# Altium project BUSBAR_18650_12S.PrjPCB
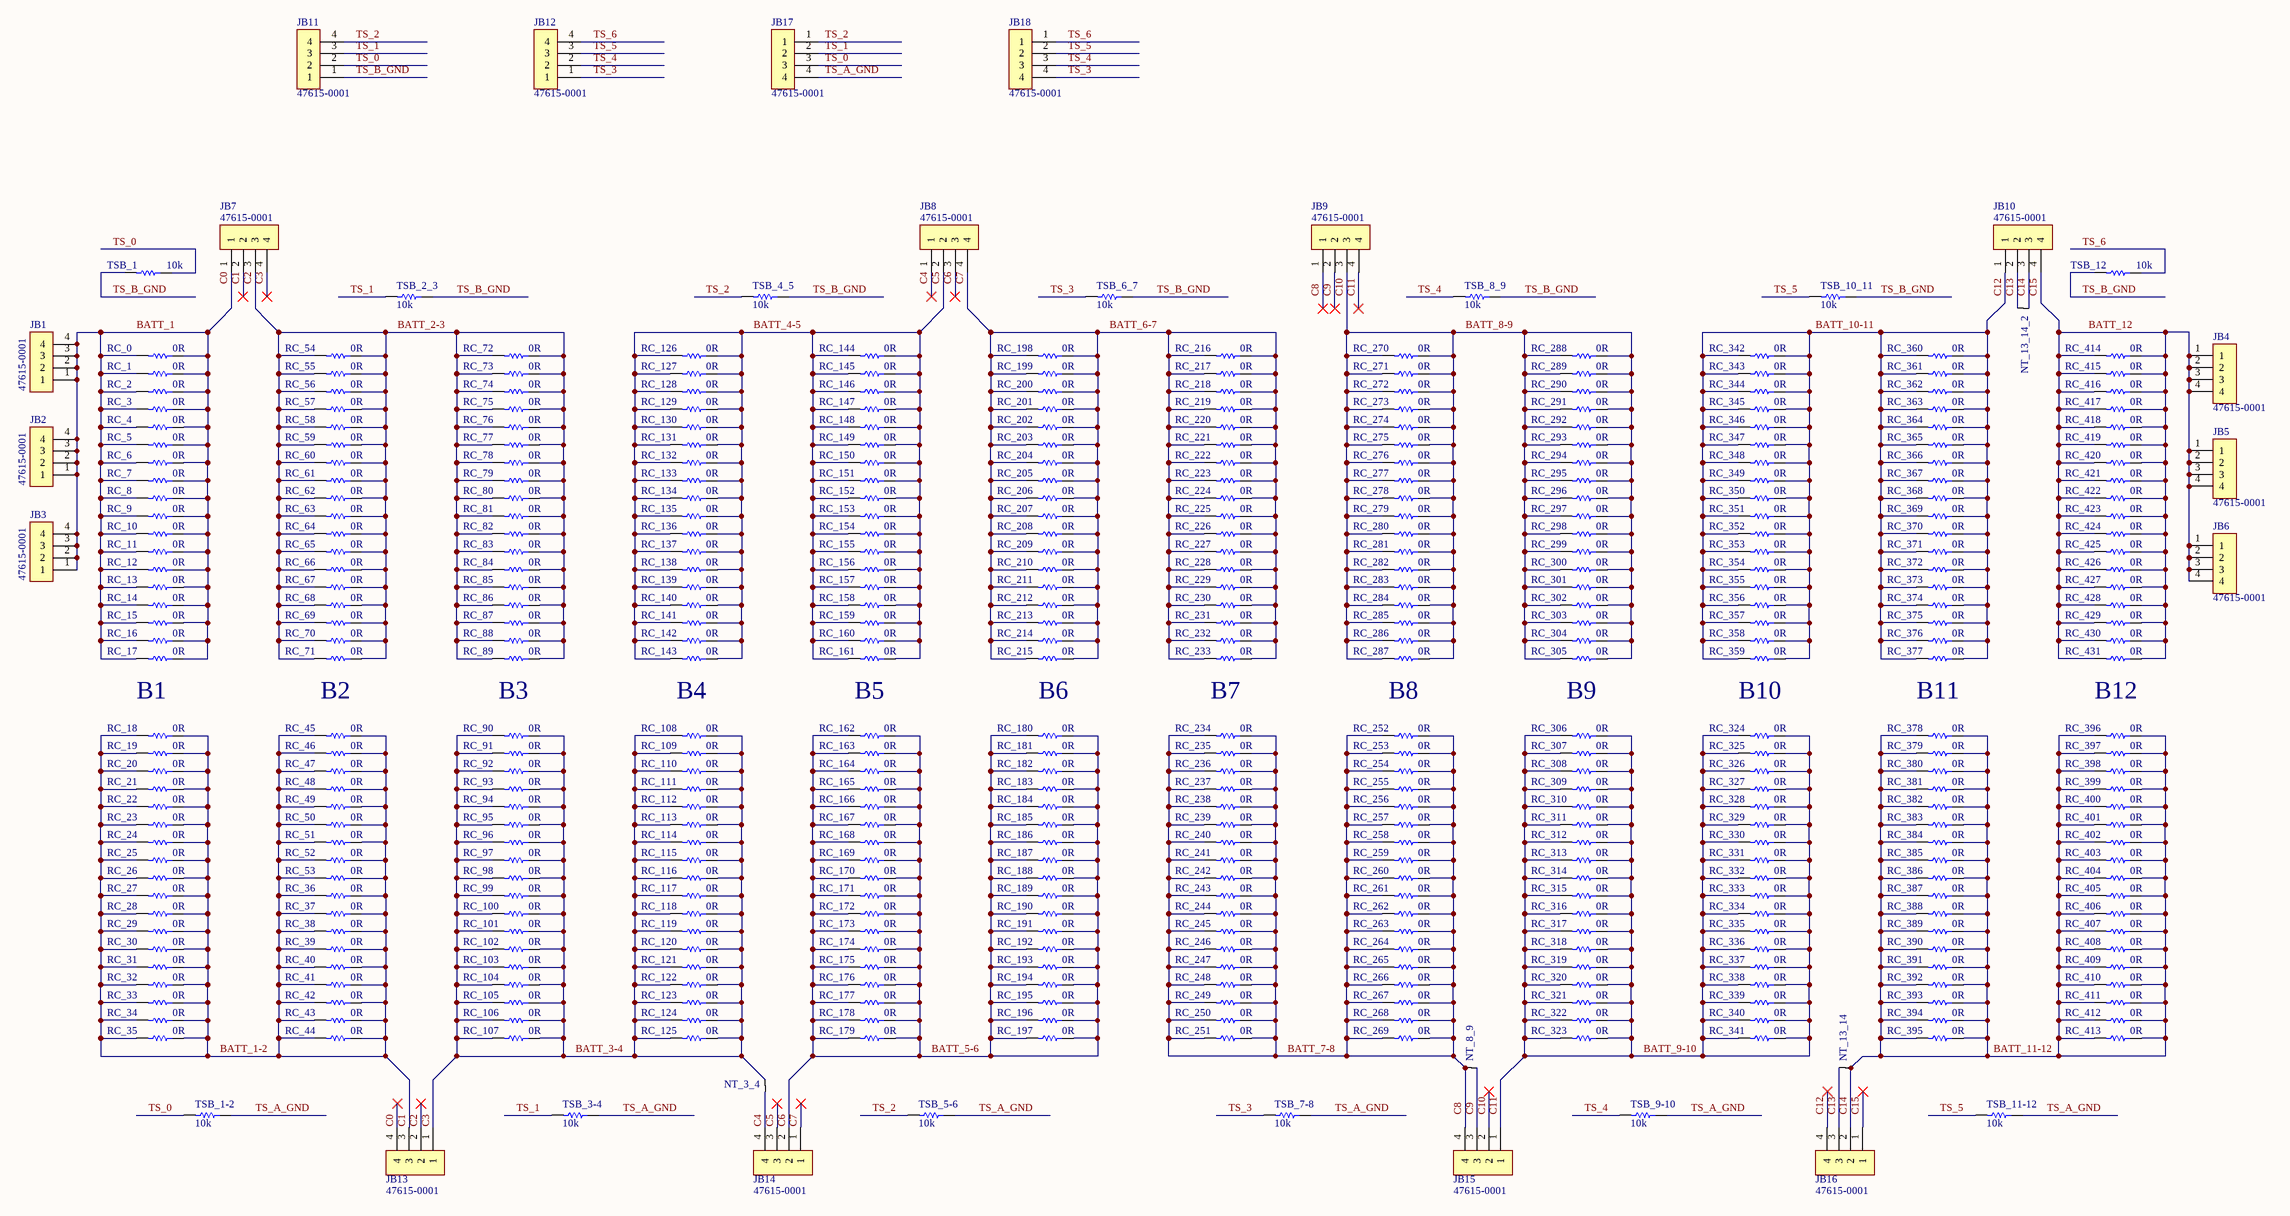
[diagram p0: BUSBAR_18650_12S.SchDoc]
1 sheet, 467 parts. Net scope: global (net labels, ports and power ports of the same name join across sheets).
Board file: BUSBAR_18650_12S.PcbDoc

## Sheet BUSBAR_18650_12S.SchDoc
size C

### Parts
JB1  47615-0001  [47615-0001]
JB2  47615-0001  [47615-0001]
JB3  47615-0001  [47615-0001]
JB4  47615-0001  [47615-0001]
JB5  47615-0001  [47615-0001]
JB6  47615-0001  [47615-0001]
JB7  47615-0001  [47615-0001]
JB8  47615-0001  [47615-0001]
JB9  47615-0001  [47615-0001]
JB10  47615-0001  [47615-0001]
JB11  47615-0001  [47615-0001]
JB12  47615-0001  [47615-0001]
JB13  47615-0001  [47615-0001]
JB14  47615-0001  [47615-0001]
JB15  47615-0001  [47615-0001]
JB16  47615-0001  [47615-0001]
JB17  47615-0001  [47615-0001]
JB18  47615-0001  [47615-0001]
NT_3_4  0  [NET_TIE]  (value not drawn)
NT_8_9  0  [NET_TIE]  (value not drawn)
NT_13_14  0  [NET_TIE]  (value not drawn)
NT_13_14_2  0  [NET_TIE]  (value not drawn)
RC_0  value 0R  [R_0603]  (hidden comment: 0603WAF0000T5E)
RC_1  value 0R  [R_0603]  (hidden comment: 0603WAF0000T5E)
RC_2  value 0R  [R_0603]  (hidden comment: 0603WAF0000T5E)
RC_3  value 0R  [R_0603]  (hidden comment: 0603WAF0000T5E)
RC_4  value 0R  [R_0603]  (hidden comment: 0603WAF0000T5E)
RC_5  value 0R  [R_0603]  (hidden comment: 0603WAF0000T5E)
RC_6  value 0R  [R_0603]  (hidden comment: 0603WAF0000T5E)
RC_7  value 0R  [R_0603]  (hidden comment: 0603WAF0000T5E)
RC_8  value 0R  [R_0603]  (hidden comment: 0603WAF0000T5E)
RC_9  value 0R  [R_0603]  (hidden comment: 0603WAF0000T5E)
RC_10  value 0R  [R_0603]  (hidden comment: 0603WAF0000T5E)
RC_11  value 0R  [R_0603]  (hidden comment: 0603WAF0000T5E)
RC_12  value 0R  [R_0603]  (hidden comment: 0603WAF0000T5E)
RC_13  value 0R  [R_0603]  (hidden comment: 0603WAF0000T5E)
RC_14  value 0R  [R_0603]  (hidden comment: 0603WAF0000T5E)
RC_15  value 0R  [R_0603]  (hidden comment: 0603WAF0000T5E)
RC_16  value 0R  [R_0603]  (hidden comment: 0603WAF0000T5E)
RC_17  value 0R  [R_0603]  (hidden comment: 0603WAF0000T5E)
RC_18  value 0R  [R_0603]  (hidden comment: 0603WAF0000T5E)
RC_19  value 0R  [R_0603]  (hidden comment: 0603WAF0000T5E)
RC_20  value 0R  [R_0603]  (hidden comment: 0603WAF0000T5E)
RC_21  value 0R  [R_0603]  (hidden comment: 0603WAF0000T5E)
RC_22  value 0R  [R_0603]  (hidden comment: 0603WAF0000T5E)
RC_23  value 0R  [R_0603]  (hidden comment: 0603WAF0000T5E)
RC_24  value 0R  [R_0603]  (hidden comment: 0603WAF0000T5E)
RC_25  value 0R  [R_0603]  (hidden comment: 0603WAF0000T5E)
RC_26  value 0R  [R_0603]  (hidden comment: 0603WAF0000T5E)
RC_27  value 0R  [R_0603]  (hidden comment: 0603WAF0000T5E)
RC_28  value 0R  [R_0603]  (hidden comment: 0603WAF0000T5E)
RC_29  value 0R  [R_0603]  (hidden comment: 0603WAF0000T5E)
RC_30  value 0R  [R_0603]  (hidden comment: 0603WAF0000T5E)
RC_31  value 0R  [R_0603]  (hidden comment: 0603WAF0000T5E)
RC_32  value 0R  [R_0603]  (hidden comment: 0603WAF0000T5E)
RC_33  value 0R  [R_0603]  (hidden comment: 0603WAF0000T5E)
RC_34  value 0R  [R_0603]  (hidden comment: 0603WAF0000T5E)
RC_35  value 0R  [R_0603]  (hidden comment: 0603WAF0000T5E)
RC_36  value 0R  [R_0603]  (hidden comment: 0603WAF0000T5E)
RC_37  value 0R  [R_0603]  (hidden comment: 0603WAF0000T5E)
RC_38  value 0R  [R_0603]  (hidden comment: 0603WAF0000T5E)
RC_39  value 0R  [R_0603]  (hidden comment: 0603WAF0000T5E)
RC_40  value 0R  [R_0603]  (hidden comment: 0603WAF0000T5E)
RC_41  value 0R  [R_0603]  (hidden comment: 0603WAF0000T5E)
RC_42  value 0R  [R_0603]  (hidden comment: 0603WAF0000T5E)
RC_43  value 0R  [R_0603]  (hidden comment: 0603WAF0000T5E)
RC_44  value 0R  [R_0603]  (hidden comment: 0603WAF0000T5E)
RC_45  value 0R  [R_0603]  (hidden comment: 0603WAF0000T5E)
RC_46  value 0R  [R_0603]  (hidden comment: 0603WAF0000T5E)
RC_47  value 0R  [R_0603]  (hidden comment: 0603WAF0000T5E)
RC_48  value 0R  [R_0603]  (hidden comment: 0603WAF0000T5E)
RC_49  value 0R  [R_0603]  (hidden comment: 0603WAF0000T5E)
RC_50  value 0R  [R_0603]  (hidden comment: 0603WAF0000T5E)
RC_51  value 0R  [R_0603]  (hidden comment: 0603WAF0000T5E)
RC_52  value 0R  [R_0603]  (hidden comment: 0603WAF0000T5E)
RC_53  value 0R  [R_0603]  (hidden comment: 0603WAF0000T5E)
RC_54  value 0R  [R_0603]  (hidden comment: 0603WAF0000T5E)
RC_55  value 0R  [R_0603]  (hidden comment: 0603WAF0000T5E)
RC_56  value 0R  [R_0603]  (hidden comment: 0603WAF0000T5E)
RC_57  value 0R  [R_0603]  (hidden comment: 0603WAF0000T5E)
RC_58  value 0R  [R_0603]  (hidden comment: 0603WAF0000T5E)
RC_59  value 0R  [R_0603]  (hidden comment: 0603WAF0000T5E)
RC_60  value 0R  [R_0603]  (hidden comment: 0603WAF0000T5E)
RC_61  value 0R  [R_0603]  (hidden comment: 0603WAF0000T5E)
RC_62  value 0R  [R_0603]  (hidden comment: 0603WAF0000T5E)
RC_63  value 0R  [R_0603]  (hidden comment: 0603WAF0000T5E)
RC_64  value 0R  [R_0603]  (hidden comment: 0603WAF0000T5E)
RC_65  value 0R  [R_0603]  (hidden comment: 0603WAF0000T5E)
RC_66  value 0R  [R_0603]  (hidden comment: 0603WAF0000T5E)
RC_67  value 0R  [R_0603]  (hidden comment: 0603WAF0000T5E)
RC_68  value 0R  [R_0603]  (hidden comment: 0603WAF0000T5E)
RC_69  value 0R  [R_0603]  (hidden comment: 0603WAF0000T5E)
RC_70  value 0R  [R_0603]  (hidden comment: 0603WAF0000T5E)
RC_71  value 0R  [R_0603]  (hidden comment: 0603WAF0000T5E)
RC_72  value 0R  [R_0603]  (hidden comment: 0603WAF0000T5E)
RC_73  value 0R  [R_0603]  (hidden comment: 0603WAF0000T5E)
RC_74  value 0R  [R_0603]  (hidden comment: 0603WAF0000T5E)
RC_75  value 0R  [R_0603]  (hidden comment: 0603WAF0000T5E)
RC_76  value 0R  [R_0603]  (hidden comment: 0603WAF0000T5E)
RC_77  value 0R  [R_0603]  (hidden comment: 0603WAF0000T5E)
RC_78  value 0R  [R_0603]  (hidden comment: 0603WAF0000T5E)
RC_79  value 0R  [R_0603]  (hidden comment: 0603WAF0000T5E)
RC_80  value 0R  [R_0603]  (hidden comment: 0603WAF0000T5E)
RC_81  value 0R  [R_0603]  (hidden comment: 0603WAF0000T5E)
RC_82  value 0R  [R_0603]  (hidden comment: 0603WAF0000T5E)
RC_83  value 0R  [R_0603]  (hidden comment: 0603WAF0000T5E)
RC_84  value 0R  [R_0603]  (hidden comment: 0603WAF0000T5E)
RC_85  value 0R  [R_0603]  (hidden comment: 0603WAF0000T5E)
RC_86  value 0R  [R_0603]  (hidden comment: 0603WAF0000T5E)
RC_87  value 0R  [R_0603]  (hidden comment: 0603WAF0000T5E)
RC_88  value 0R  [R_0603]  (hidden comment: 0603WAF0000T5E)
RC_89  value 0R  [R_0603]  (hidden comment: 0603WAF0000T5E)
RC_90  value 0R  [R_0603]  (hidden comment: 0603WAF0000T5E)
RC_91  value 0R  [R_0603]  (hidden comment: 0603WAF0000T5E)
RC_92  value 0R  [R_0603]  (hidden comment: 0603WAF0000T5E)
RC_93  value 0R  [R_0603]  (hidden comment: 0603WAF0000T5E)
RC_94  value 0R  [R_0603]  (hidden comment: 0603WAF0000T5E)
RC_95  value 0R  [R_0603]  (hidden comment: 0603WAF0000T5E)
RC_96  value 0R  [R_0603]  (hidden comment: 0603WAF0000T5E)
RC_97  value 0R  [R_0603]  (hidden comment: 0603WAF0000T5E)
RC_98  value 0R  [R_0603]  (hidden comment: 0603WAF0000T5E)
RC_99  value 0R  [R_0603]  (hidden comment: 0603WAF0000T5E)
RC_100  value 0R  [R_0603]  (hidden comment: 0603WAF0000T5E)
RC_101  value 0R  [R_0603]  (hidden comment: 0603WAF0000T5E)
RC_102  value 0R  [R_0603]  (hidden comment: 0603WAF0000T5E)
RC_103  value 0R  [R_0603]  (hidden comment: 0603WAF0000T5E)
RC_104  value 0R  [R_0603]  (hidden comment: 0603WAF0000T5E)
RC_105  value 0R  [R_0603]  (hidden comment: 0603WAF0000T5E)
RC_106  value 0R  [R_0603]  (hidden comment: 0603WAF0000T5E)
RC_107  value 0R  [R_0603]  (hidden comment: 0603WAF0000T5E)
RC_108  value 0R  [R_0603]  (hidden comment: 0603WAF0000T5E)
RC_109  value 0R  [R_0603]  (hidden comment: 0603WAF0000T5E)
RC_110  value 0R  [R_0603]  (hidden comment: 0603WAF0000T5E)
RC_111  value 0R  [R_0603]  (hidden comment: 0603WAF0000T5E)
RC_112  value 0R  [R_0603]  (hidden comment: 0603WAF0000T5E)
RC_113  value 0R  [R_0603]  (hidden comment: 0603WAF0000T5E)
RC_114  value 0R  [R_0603]  (hidden comment: 0603WAF0000T5E)
RC_115  value 0R  [R_0603]  (hidden comment: 0603WAF0000T5E)
RC_116  value 0R  [R_0603]  (hidden comment: 0603WAF0000T5E)
RC_117  value 0R  [R_0603]  (hidden comment: 0603WAF0000T5E)
RC_118  value 0R  [R_0603]  (hidden comment: 0603WAF0000T5E)
RC_119  value 0R  [R_0603]  (hidden comment: 0603WAF0000T5E)
RC_120  value 0R  [R_0603]  (hidden comment: 0603WAF0000T5E)
RC_121  value 0R  [R_0603]  (hidden comment: 0603WAF0000T5E)
RC_122  value 0R  [R_0603]  (hidden comment: 0603WAF0000T5E)
RC_123  value 0R  [R_0603]  (hidden comment: 0603WAF0000T5E)
RC_124  value 0R  [R_0603]  (hidden comment: 0603WAF0000T5E)
RC_125  value 0R  [R_0603]  (hidden comment: 0603WAF0000T5E)
RC_126  value 0R  [R_0603]  (hidden comment: 0603WAF0000T5E)
RC_127  value 0R  [R_0603]  (hidden comment: 0603WAF0000T5E)
RC_128  value 0R  [R_0603]  (hidden comment: 0603WAF0000T5E)
RC_129  value 0R  [R_0603]  (hidden comment: 0603WAF0000T5E)
RC_130  value 0R  [R_0603]  (hidden comment: 0603WAF0000T5E)
RC_131  value 0R  [R_0603]  (hidden comment: 0603WAF0000T5E)
RC_132  value 0R  [R_0603]  (hidden comment: 0603WAF0000T5E)
RC_133  value 0R  [R_0603]  (hidden comment: 0603WAF0000T5E)
RC_134  value 0R  [R_0603]  (hidden comment: 0603WAF0000T5E)
RC_135  value 0R  [R_0603]  (hidden comment: 0603WAF0000T5E)
RC_136  value 0R  [R_0603]  (hidden comment: 0603WAF0000T5E)
RC_137  value 0R  [R_0603]  (hidden comment: 0603WAF0000T5E)
RC_138  value 0R  [R_0603]  (hidden comment: 0603WAF0000T5E)
RC_139  value 0R  [R_0603]  (hidden comment: 0603WAF0000T5E)
RC_140  value 0R  [R_0603]  (hidden comment: 0603WAF0000T5E)
RC_141  value 0R  [R_0603]  (hidden comment: 0603WAF0000T5E)
RC_142  value 0R  [R_0603]  (hidden comment: 0603WAF0000T5E)
RC_143  value 0R  [R_0603]  (hidden comment: 0603WAF0000T5E)
RC_144  value 0R  [R_0603]  (hidden comment: 0603WAF0000T5E)
RC_145  value 0R  [R_0603]  (hidden comment: 0603WAF0000T5E)
RC_146  value 0R  [R_0603]  (hidden comment: 0603WAF0000T5E)
RC_147  value 0R  [R_0603]  (hidden comment: 0603WAF0000T5E)
RC_148  value 0R  [R_0603]  (hidden comment: 0603WAF0000T5E)
RC_149  value 0R  [R_0603]  (hidden comment: 0603WAF0000T5E)
RC_150  value 0R  [R_0603]  (hidden comment: 0603WAF0000T5E)
RC_151  value 0R  [R_0603]  (hidden comment: 0603WAF0000T5E)
RC_152  value 0R  [R_0603]  (hidden comment: 0603WAF0000T5E)
RC_153  value 0R  [R_0603]  (hidden comment: 0603WAF0000T5E)
RC_154  value 0R  [R_0603]  (hidden comment: 0603WAF0000T5E)
RC_155  value 0R  [R_0603]  (hidden comment: 0603WAF0000T5E)
RC_156  value 0R  [R_0603]  (hidden comment: 0603WAF0000T5E)
RC_157  value 0R  [R_0603]  (hidden comment: 0603WAF0000T5E)
RC_158  value 0R  [R_0603]  (hidden comment: 0603WAF0000T5E)
RC_159  value 0R  [R_0603]  (hidden comment: 0603WAF0000T5E)
RC_160  value 0R  [R_0603]  (hidden comment: 0603WAF0000T5E)
RC_161  value 0R  [R_0603]  (hidden comment: 0603WAF0000T5E)
RC_162  value 0R  [R_0603]  (hidden comment: 0603WAF0000T5E)
RC_163  value 0R  [R_0603]  (hidden comment: 0603WAF0000T5E)
RC_164  value 0R  [R_0603]  (hidden comment: 0603WAF0000T5E)
RC_165  value 0R  [R_0603]  (hidden comment: 0603WAF0000T5E)
RC_166  value 0R  [R_0603]  (hidden comment: 0603WAF0000T5E)
RC_167  value 0R  [R_0603]  (hidden comment: 0603WAF0000T5E)
RC_168  value 0R  [R_0603]  (hidden comment: 0603WAF0000T5E)
RC_169  value 0R  [R_0603]  (hidden comment: 0603WAF0000T5E)
RC_170  value 0R  [R_0603]  (hidden comment: 0603WAF0000T5E)
RC_171  value 0R  [R_0603]  (hidden comment: 0603WAF0000T5E)
RC_172  value 0R  [R_0603]  (hidden comment: 0603WAF0000T5E)
RC_173  value 0R  [R_0603]  (hidden comment: 0603WAF0000T5E)
RC_174  value 0R  [R_0603]  (hidden comment: 0603WAF0000T5E)
RC_175  value 0R  [R_0603]  (hidden comment: 0603WAF0000T5E)
RC_176  value 0R  [R_0603]  (hidden comment: 0603WAF0000T5E)
RC_177  value 0R  [R_0603]  (hidden comment: 0603WAF0000T5E)
RC_178  value 0R  [R_0603]  (hidden comment: 0603WAF0000T5E)
RC_179  value 0R  [R_0603]  (hidden comment: 0603WAF0000T5E)
RC_180  value 0R  [R_0603]  (hidden comment: 0603WAF0000T5E)
RC_181  value 0R  [R_0603]  (hidden comment: 0603WAF0000T5E)
RC_182  value 0R  [R_0603]  (hidden comment: 0603WAF0000T5E)
RC_183  value 0R  [R_0603]  (hidden comment: 0603WAF0000T5E)
RC_184  value 0R  [R_0603]  (hidden comment: 0603WAF0000T5E)
RC_185  value 0R  [R_0603]  (hidden comment: 0603WAF0000T5E)
RC_186  value 0R  [R_0603]  (hidden comment: 0603WAF0000T5E)
RC_187  value 0R  [R_0603]  (hidden comment: 0603WAF0000T5E)
RC_188  value 0R  [R_0603]  (hidden comment: 0603WAF0000T5E)
RC_189  value 0R  [R_0603]  (hidden comment: 0603WAF0000T5E)
RC_190  value 0R  [R_0603]  (hidden comment: 0603WAF0000T5E)
RC_191  value 0R  [R_0603]  (hidden comment: 0603WAF0000T5E)
RC_192  value 0R  [R_0603]  (hidden comment: 0603WAF0000T5E)
RC_193  value 0R  [R_0603]  (hidden comment: 0603WAF0000T5E)
RC_194  value 0R  [R_0603]  (hidden comment: 0603WAF0000T5E)
RC_195  value 0R  [R_0603]  (hidden comment: 0603WAF0000T5E)
RC_196  value 0R  [R_0603]  (hidden comment: 0603WAF0000T5E)
RC_197  value 0R  [R_0603]  (hidden comment: 0603WAF0000T5E)
RC_198  value 0R  [R_0603]  (hidden comment: 0603WAF0000T5E)
RC_199  value 0R  [R_0603]  (hidden comment: 0603WAF0000T5E)
RC_200  value 0R  [R_0603]  (hidden comment: 0603WAF0000T5E)
RC_201  value 0R  [R_0603]  (hidden comment: 0603WAF0000T5E)
RC_202  value 0R  [R_0603]  (hidden comment: 0603WAF0000T5E)
RC_203  value 0R  [R_0603]  (hidden comment: 0603WAF0000T5E)
RC_204  value 0R  [R_0603]  (hidden comment: 0603WAF0000T5E)
RC_205  value 0R  [R_0603]  (hidden comment: 0603WAF0000T5E)
RC_206  value 0R  [R_0603]  (hidden comment: 0603WAF0000T5E)
RC_207  value 0R  [R_0603]  (hidden comment: 0603WAF0000T5E)
RC_208  value 0R  [R_0603]  (hidden comment: 0603WAF0000T5E)
RC_209  value 0R  [R_0603]  (hidden comment: 0603WAF0000T5E)
RC_210  value 0R  [R_0603]  (hidden comment: 0603WAF0000T5E)
RC_211  value 0R  [R_0603]  (hidden comment: 0603WAF0000T5E)
RC_212  value 0R  [R_0603]  (hidden comment: 0603WAF0000T5E)
RC_213  value 0R  [R_0603]  (hidden comment: 0603WAF0000T5E)
RC_214  value 0R  [R_0603]  (hidden comment: 0603WAF0000T5E)
RC_215  value 0R  [R_0603]  (hidden comment: 0603WAF0000T5E)
RC_216  value 0R  [R_0603]  (hidden comment: 0603WAF0000T5E)
RC_217  value 0R  [R_0603]  (hidden comment: 0603WAF0000T5E)
RC_218  value 0R  [R_0603]  (hidden comment: 0603WAF0000T5E)
RC_219  value 0R  [R_0603]  (hidden comment: 0603WAF0000T5E)
RC_220  value 0R  [R_0603]  (hidden comment: 0603WAF0000T5E)
RC_221  value 0R  [R_0603]  (hidden comment: 0603WAF0000T5E)
RC_222  value 0R  [R_0603]  (hidden comment: 0603WAF0000T5E)
RC_223  value 0R  [R_0603]  (hidden comment: 0603WAF0000T5E)
RC_224  value 0R  [R_0603]  (hidden comment: 0603WAF0000T5E)
RC_225  value 0R  [R_0603]  (hidden comment: 0603WAF0000T5E)
RC_226  value 0R  [R_0603]  (hidden comment: 0603WAF0000T5E)
RC_227  value 0R  [R_0603]  (hidden comment: 0603WAF0000T5E)
RC_228  value 0R  [R_0603]  (hidden comment: 0603WAF0000T5E)
RC_229  value 0R  [R_0603]  (hidden comment: 0603WAF0000T5E)
RC_230  value 0R  [R_0603]  (hidden comment: 0603WAF0000T5E)
RC_231  value 0R  [R_0603]  (hidden comment: 0603WAF0000T5E)
RC_232  value 0R  [R_0603]  (hidden comment: 0603WAF0000T5E)
RC_233  value 0R  [R_0603]  (hidden comment: 0603WAF0000T5E)
RC_234  value 0R  [R_0603]  (hidden comment: 0603WAF0000T5E)
RC_235  value 0R  [R_0603]  (hidden comment: 0603WAF0000T5E)
RC_236  value 0R  [R_0603]  (hidden comment: 0603WAF0000T5E)
RC_237  value 0R  [R_0603]  (hidden comment: 0603WAF0000T5E)
RC_238  value 0R  [R_0603]  (hidden comment: 0603WAF0000T5E)
RC_239  value 0R  [R_0603]  (hidden comment: 0603WAF0000T5E)
RC_240  value 0R  [R_0603]  (hidden comment: 0603WAF0000T5E)
RC_241  value 0R  [R_0603]  (hidden comment: 0603WAF0000T5E)
RC_242  value 0R  [R_0603]  (hidden comment: 0603WAF0000T5E)
RC_243  value 0R  [R_0603]  (hidden comment: 0603WAF0000T5E)
RC_244  value 0R  [R_0603]  (hidden comment: 0603WAF0000T5E)
RC_245  value 0R  [R_0603]  (hidden comment: 0603WAF0000T5E)
RC_246  value 0R  [R_0603]  (hidden comment: 0603WAF0000T5E)
RC_247  value 0R  [R_0603]  (hidden comment: 0603WAF0000T5E)
RC_248  value 0R  [R_0603]  (hidden comment: 0603WAF0000T5E)
RC_249  value 0R  [R_0603]  (hidden comment: 0603WAF0000T5E)
RC_250  value 0R  [R_0603]  (hidden comment: 0603WAF0000T5E)
RC_251  value 0R  [R_0603]  (hidden comment: 0603WAF0000T5E)
RC_252  value 0R  [R_0603]  (hidden comment: 0603WAF0000T5E)
RC_253  value 0R  [R_0603]  (hidden comment: 0603WAF0000T5E)
RC_254  value 0R  [R_0603]  (hidden comment: 0603WAF0000T5E)
RC_255  value 0R  [R_0603]  (hidden comment: 0603WAF0000T5E)
RC_256  value 0R  [R_0603]  (hidden comment: 0603WAF0000T5E)
RC_257  value 0R  [R_0603]  (hidden comment: 0603WAF0000T5E)
RC_258  value 0R  [R_0603]  (hidden comment: 0603WAF0000T5E)
RC_259  value 0R  [R_0603]  (hidden comment: 0603WAF0000T5E)
RC_260  value 0R  [R_0603]  (hidden comment: 0603WAF0000T5E)
RC_261  value 0R  [R_0603]  (hidden comment: 0603WAF0000T5E)
RC_262  value 0R  [R_0603]  (hidden comment: 0603WAF0000T5E)
RC_263  value 0R  [R_0603]  (hidden comment: 0603WAF0000T5E)
RC_264  value 0R  [R_0603]  (hidden comment: 0603WAF0000T5E)
RC_265  value 0R  [R_0603]  (hidden comment: 0603WAF0000T5E)
RC_266  value 0R  [R_0603]  (hidden comment: 0603WAF0000T5E)
RC_267  value 0R  [R_0603]  (hidden comment: 0603WAF0000T5E)
RC_268  value 0R  [R_0603]  (hidden comment: 0603WAF0000T5E)
RC_269  value 0R  [R_0603]  (hidden comment: 0603WAF0000T5E)
RC_270  value 0R  [R_0603]  (hidden comment: 0603WAF0000T5E)
RC_271  value 0R  [R_0603]  (hidden comment: 0603WAF0000T5E)
RC_272  value 0R  [R_0603]  (hidden comment: 0603WAF0000T5E)
RC_273  value 0R  [R_0603]  (hidden comment: 0603WAF0000T5E)
RC_274  value 0R  [R_0603]  (hidden comment: 0603WAF0000T5E)
RC_275  value 0R  [R_0603]  (hidden comment: 0603WAF0000T5E)
RC_276  value 0R  [R_0603]  (hidden comment: 0603WAF0000T5E)
RC_277  value 0R  [R_0603]  (hidden comment: 0603WAF0000T5E)
RC_278  value 0R  [R_0603]  (hidden comment: 0603WAF0000T5E)
RC_279  value 0R  [R_0603]  (hidden comment: 0603WAF0000T5E)
RC_280  value 0R  [R_0603]  (hidden comment: 0603WAF0000T5E)
RC_281  value 0R  [R_0603]  (hidden comment: 0603WAF0000T5E)
RC_282  value 0R  [R_0603]  (hidden comment: 0603WAF0000T5E)
RC_283  value 0R  [R_0603]  (hidden comment: 0603WAF0000T5E)
RC_284  value 0R  [R_0603]  (hidden comment: 0603WAF0000T5E)
RC_285  value 0R  [R_0603]  (hidden comment: 0603WAF0000T5E)
RC_286  value 0R  [R_0603]  (hidden comment: 0603WAF0000T5E)
RC_287  value 0R  [R_0603]  (hidden comment: 0603WAF0000T5E)
RC_288  value 0R  [R_0603]  (hidden comment: 0603WAF0000T5E)
RC_289  value 0R  [R_0603]  (hidden comment: 0603WAF0000T5E)
RC_290  value 0R  [R_0603]  (hidden comment: 0603WAF0000T5E)
RC_291  value 0R  [R_0603]  (hidden comment: 0603WAF0000T5E)
RC_292  value 0R  [R_0603]  (hidden comment: 0603WAF0000T5E)
RC_293  value 0R  [R_0603]  (hidden comment: 0603WAF0000T5E)
RC_294  value 0R  [R_0603]  (hidden comment: 0603WAF0000T5E)
RC_295  value 0R  [R_0603]  (hidden comment: 0603WAF0000T5E)
RC_296  value 0R  [R_0603]  (hidden comment: 0603WAF0000T5E)
RC_297  value 0R  [R_0603]  (hidden comment: 0603WAF0000T5E)
RC_298  value 0R  [R_0603]  (hidden comment: 0603WAF0000T5E)
RC_299  value 0R  [R_0603]  (hidden comment: 0603WAF0000T5E)
RC_300  value 0R  [R_0603]  (hidden comment: 0603WAF0000T5E)
RC_301  value 0R  [R_0603]  (hidden comment: 0603WAF0000T5E)
RC_302  value 0R  [R_0603]  (hidden comment: 0603WAF0000T5E)
RC_303  value 0R  [R_0603]  (hidden comment: 0603WAF0000T5E)
RC_304  value 0R  [R_0603]  (hidden comment: 0603WAF0000T5E)
RC_305  value 0R  [R_0603]  (hidden comment: 0603WAF0000T5E)
RC_306  value 0R  [R_0603]  (hidden comment: 0603WAF0000T5E)
RC_307  value 0R  [R_0603]  (hidden comment: 0603WAF0000T5E)
RC_308  value 0R  [R_0603]  (hidden comment: 0603WAF0000T5E)
RC_309  value 0R  [R_0603]  (hidden comment: 0603WAF0000T5E)
RC_310  value 0R  [R_0603]  (hidden comment: 0603WAF0000T5E)
RC_311  value 0R  [R_0603]  (hidden comment: 0603WAF0000T5E)
RC_312  value 0R  [R_0603]  (hidden comment: 0603WAF0000T5E)
RC_313  value 0R  [R_0603]  (hidden comment: 0603WAF0000T5E)
RC_314  value 0R  [R_0603]  (hidden comment: 0603WAF0000T5E)
RC_315  value 0R  [R_0603]  (hidden comment: 0603WAF0000T5E)
RC_316  value 0R  [R_0603]  (hidden comment: 0603WAF0000T5E)
RC_317  value 0R  [R_0603]  (hidden comment: 0603WAF0000T5E)
RC_318  value 0R  [R_0603]  (hidden comment: 0603WAF0000T5E)
RC_319  value 0R  [R_0603]  (hidden comment: 0603WAF0000T5E)
RC_320  value 0R  [R_0603]  (hidden comment: 0603WAF0000T5E)
RC_321  value 0R  [R_0603]  (hidden comment: 0603WAF0000T5E)
RC_322  value 0R  [R_0603]  (hidden comment: 0603WAF0000T5E)
RC_323  value 0R  [R_0603]  (hidden comment: 0603WAF0000T5E)
RC_324  value 0R  [R_0603]  (hidden comment: 0603WAF0000T5E)
RC_325  value 0R  [R_0603]  (hidden comment: 0603WAF0000T5E)
RC_326  value 0R  [R_0603]  (hidden comment: 0603WAF0000T5E)
RC_327  value 0R  [R_0603]  (hidden comment: 0603WAF0000T5E)
RC_328  value 0R  [R_0603]  (hidden comment: 0603WAF0000T5E)
RC_329  value 0R  [R_0603]  (hidden comment: 0603WAF0000T5E)
RC_330  value 0R  [R_0603]  (hidden comment: 0603WAF0000T5E)
RC_331  value 0R  [R_0603]  (hidden comment: 0603WAF0000T5E)
RC_332  value 0R  [R_0603]  (hidden comment: 0603WAF0000T5E)
RC_333  value 0R  [R_0603]  (hidden comment: 0603WAF0000T5E)
RC_334  value 0R  [R_0603]  (hidden comment: 0603WAF0000T5E)
RC_335  value 0R  [R_0603]  (hidden comment: 0603WAF0000T5E)
RC_336  value 0R  [R_0603]  (hidden comment: 0603WAF0000T5E)
RC_337  value 0R  [R_0603]  (hidden comment: 0603WAF0000T5E)
RC_338  value 0R  [R_0603]  (hidden comment: 0603WAF0000T5E)
RC_339  value 0R  [R_0603]  (hidden comment: 0603WAF0000T5E)
RC_340  value 0R  [R_0603]  (hidden comment: 0603WAF0000T5E)
RC_341  value 0R  [R_0603]  (hidden comment: 0603WAF0000T5E)
RC_342  value 0R  [R_0603]  (hidden comment: 0603WAF0000T5E)
RC_343  value 0R  [R_0603]  (hidden comment: 0603WAF0000T5E)
RC_344  value 0R  [R_0603]  (hidden comment: 0603WAF0000T5E)
RC_345  value 0R  [R_0603]  (hidden comment: 0603WAF0000T5E)
RC_346  value 0R  [R_0603]  (hidden comment: 0603WAF0000T5E)
RC_347  value 0R  [R_0603]  (hidden comment: 0603WAF0000T5E)
RC_348  value 0R  [R_0603]  (hidden comment: 0603WAF0000T5E)
RC_349  value 0R  [R_0603]  (hidden comment: 0603WAF0000T5E)
RC_350  value 0R  [R_0603]  (hidden comment: 0603WAF0000T5E)
RC_351  value 0R  [R_0603]  (hidden comment: 0603WAF0000T5E)
RC_352  value 0R  [R_0603]  (hidden comment: 0603WAF0000T5E)
RC_353  value 0R  [R_0603]  (hidden comment: 0603WAF0000T5E)
RC_354  value 0R  [R_0603]  (hidden comment: 0603WAF0000T5E)
RC_355  value 0R  [R_0603]  (hidden comment: 0603WAF0000T5E)
RC_356  value 0R  [R_0603]  (hidden comment: 0603WAF0000T5E)
RC_357  value 0R  [R_0603]  (hidden comment: 0603WAF0000T5E)
RC_358  value 0R  [R_0603]  (hidden comment: 0603WAF0000T5E)
RC_359  value 0R  [R_0603]  (hidden comment: 0603WAF0000T5E)
RC_360  value 0R  [R_0603]  (hidden comment: 0603WAF0000T5E)
RC_361  value 0R  [R_0603]  (hidden comment: 0603WAF0000T5E)
RC_362  value 0R  [R_0603]  (hidden comment: 0603WAF0000T5E)
RC_363  value 0R  [R_0603]  (hidden comment: 0603WAF0000T5E)
RC_364  value 0R  [R_0603]  (hidden comment: 0603WAF0000T5E)
RC_365  value 0R  [R_0603]  (hidden comment: 0603WAF0000T5E)
RC_366  value 0R  [R_0603]  (hidden comment: 0603WAF0000T5E)
RC_367  value 0R  [R_0603]  (hidden comment: 0603WAF0000T5E)
RC_368  value 0R  [R_0603]  (hidden comment: 0603WAF0000T5E)
RC_369  value 0R  [R_0603]  (hidden comment: 0603WAF0000T5E)
RC_370  value 0R  [R_0603]  (hidden comment: 0603WAF0000T5E)
RC_371  value 0R  [R_0603]  (hidden comment: 0603WAF0000T5E)
RC_372  value 0R  [R_0603]  (hidden comment: 0603WAF0000T5E)
RC_373  value 0R  [R_0603]  (hidden comment: 0603WAF0000T5E)
RC_374  value 0R  [R_0603]  (hidden comment: 0603WAF0000T5E)
RC_375  value 0R  [R_0603]  (hidden comment: 0603WAF0000T5E)
RC_376  value 0R  [R_0603]  (hidden comment: 0603WAF0000T5E)
RC_377  value 0R  [R_0603]  (hidden comment: 0603WAF0000T5E)
RC_378  value 0R  [R_0603]  (hidden comment: 0603WAF0000T5E)
RC_379  value 0R  [R_0603]  (hidden comment: 0603WAF0000T5E)
RC_380  value 0R  [R_0603]  (hidden comment: 0603WAF0000T5E)
RC_381  value 0R  [R_0603]  (hidden comment: 0603WAF0000T5E)
RC_382  value 0R  [R_0603]  (hidden comment: 0603WAF0000T5E)
RC_383  value 0R  [R_0603]  (hidden comment: 0603WAF0000T5E)
RC_384  value 0R  [R_0603]  (hidden comment: 0603WAF0000T5E)
RC_385  value 0R  [R_0603]  (hidden comment: 0603WAF0000T5E)
RC_386  value 0R  [R_0603]  (hidden comment: 0603WAF0000T5E)
RC_387  value 0R  [R_0603]  (hidden comment: 0603WAF0000T5E)
RC_388  value 0R  [R_0603]  (hidden comment: 0603WAF0000T5E)
RC_389  value 0R  [R_0603]  (hidden comment: 0603WAF0000T5E)
RC_390  value 0R  [R_0603]  (hidden comment: 0603WAF0000T5E)
RC_391  value 0R  [R_0603]  (hidden comment: 0603WAF0000T5E)
RC_392  value 0R  [R_0603]  (hidden comment: 0603WAF0000T5E)
RC_393  value 0R  [R_0603]  (hidden comment: 0603WAF0000T5E)
RC_394  value 0R  [R_0603]  (hidden comment: 0603WAF0000T5E)
RC_395  value 0R  [R_0603]  (hidden comment: 0603WAF0000T5E)
RC_396  value 0R  [R_0603]  (hidden comment: 0603WAF0000T5E)
RC_397  value 0R  [R_0603]  (hidden comment: 0603WAF0000T5E)
RC_398  value 0R  [R_0603]  (hidden comment: 0603WAF0000T5E)
RC_399  value 0R  [R_0603]  (hidden comment: 0603WAF0000T5E)
RC_400  value 0R  [R_0603]  (hidden comment: 0603WAF0000T5E)
RC_401  value 0R  [R_0603]  (hidden comment: 0603WAF0000T5E)
RC_402  value 0R  [R_0603]  (hidden comment: 0603WAF0000T5E)
RC_403  value 0R  [R_0603]  (hidden comment: 0603WAF0000T5E)
RC_404  value 0R  [R_0603]  (hidden comment: 0603WAF0000T5E)
RC_405  value 0R  [R_0603]  (hidden comment: 0603WAF0000T5E)
RC_406  value 0R  [R_0603]  (hidden comment: 0603WAF0000T5E)
RC_407  value 0R  [R_0603]  (hidden comment: 0603WAF0000T5E)
RC_408  value 0R  [R_0603]  (hidden comment: 0603WAF0000T5E)
RC_409  value 0R  [R_0603]  (hidden comment: 0603WAF0000T5E)
RC_410  value 0R  [R_0603]  (hidden comment: 0603WAF0000T5E)
RC_411  value 0R  [R_0603]  (hidden comment: 0603WAF0000T5E)
RC_412  value 0R  [R_0603]  (hidden comment: 0603WAF0000T5E)
RC_413  value 0R  [R_0603]  (hidden comment: 0603WAF0000T5E)
RC_414  value 0R  [R_0603]  (hidden comment: 0603WAF0000T5E)
RC_415  value 0R  [R_0603]  (hidden comment: 0603WAF0000T5E)
RC_416  value 0R  [R_0603]  (hidden comment: 0603WAF0000T5E)
RC_417  value 0R  [R_0603]  (hidden comment: 0603WAF0000T5E)
RC_418  value 0R  [R_0603]  (hidden comment: 0603WAF0000T5E)
RC_419  value 0R  [R_0603]  (hidden comment: 0603WAF0000T5E)
RC_420  value 0R  [R_0603]  (hidden comment: 0603WAF0000T5E)
RC_421  value 0R  [R_0603]  (hidden comment: 0603WAF0000T5E)
RC_422  value 0R  [R_0603]  (hidden comment: 0603WAF0000T5E)
RC_423  value 0R  [R_0603]  (hidden comment: 0603WAF0000T5E)
RC_424  value 0R  [R_0603]  (hidden comment: 0603WAF0000T5E)
RC_425  value 0R  [R_0603]  (hidden comment: 0603WAF0000T5E)
RC_426  value 0R  [R_0603]  (hidden comment: 0603WAF0000T5E)
RC_427  value 0R  [R_0603]  (hidden comment: 0603WAF0000T5E)
RC_428  value 0R  [R_0603]  (hidden comment: 0603WAF0000T5E)
RC_429  value 0R  [R_0603]  (hidden comment: 0603WAF0000T5E)
RC_430  value 0R  [R_0603]  (hidden comment: 0603WAF0000T5E)
RC_431  value 0R  [R_0603]  (hidden comment: 0603WAF0000T5E)
TSB_1  value 10k  [R_0402]  (hidden comment: NCP15XH103F03RC)
TSB_1-2  value 10k  [R_0402]  (hidden comment: NCP15XH103F03RC)
TSB_2_3  value 10k  [R_0402]  (hidden comment: NCP15XH103F03RC)
TSB_3-4  value 10k  [R_0402]  (hidden comment: NCP15XH103F03RC)
TSB_4_5  value 10k  [R_0402]  (hidden comment: NCP15XH103F03RC)
TSB_5-6  value 10k  [R_0402]  (hidden comment: NCP15XH103F03RC)
TSB_6_7  value 10k  [R_0402]  (hidden comment: NCP15XH103F03RC)
TSB_7-8  value 10k  [R_0402]  (hidden comment: NCP15XH103F03RC)
TSB_8_9  value 10k  [R_0402]  (hidden comment: NCP15XH103F03RC)
TSB_9-10  value 10k  [R_0402]  (hidden comment: NCP15XH103F03RC)
TSB_10_11  value 10k  [R_0402]  (hidden comment: NCP15XH103F03RC)
TSB_11-12  value 10k  [R_0402]  (hidden comment: NCP15XH103F03RC)
TSB_12  value 10k  [R_0402]  (hidden comment: NCP15XH103F03RC)

### Nets
BATT_1: JB1.1 JB1.2 JB1.3 JB1.4 JB2.1 JB2.2 JB2.3 JB2.4 JB3.1 JB3.2 JB3.3 JB3.4 JB7.1 JB13.4 RC_0.1 RC_0.2 RC_1.1 RC_1.2 RC_2.1 RC_2.2 RC_3.1 RC_3.2 RC_4.1 RC_4.2 RC_5.1 RC_5.2 RC_6.1 RC_6.2 RC_7.1 RC_7.2 RC_8.1 RC_8.2 RC_9.1 RC_9.2 RC_10.1 RC_10.2 RC_11.1 RC_11.2 RC_12.1 RC_12.2 RC_13.1 RC_13.2 RC_14.1 RC_14.2 RC_15.1 RC_15.2 RC_16.1 RC_16.2 RC_17.1 RC_17.2  [also labelled C0]
BATT_1-2: JB7.2 JB13.3 RC_18.1 RC_18.2 RC_19.1 RC_19.2 RC_20.1 RC_20.2 RC_21.1 RC_21.2 RC_22.1 RC_22.2 RC_23.1 RC_23.2 RC_24.1 RC_24.2 RC_25.1 RC_25.2 RC_26.1 RC_26.2 RC_27.1 RC_27.2 RC_28.1 RC_28.2 RC_29.1 RC_29.2 RC_30.1 RC_30.2 RC_31.1 RC_31.2 RC_32.1 RC_32.2 RC_33.1 RC_33.2 RC_34.1 RC_34.2 RC_35.1 RC_35.2 RC_36.1 RC_36.2 RC_37.1 RC_37.2 RC_38.1 RC_38.2 RC_39.1 RC_39.2 RC_40.1 RC_40.2 RC_41.1 RC_41.2 RC_42.1 RC_42.2 RC_43.1 RC_43.2 RC_44.1 RC_44.2 RC_45.1 RC_45.2 RC_46.1 RC_46.2 RC_47.1 RC_47.2 RC_48.1 RC_48.2 RC_49.1 RC_49.2 RC_50.1 RC_50.2 RC_51.1 RC_51.2 RC_52.1 RC_52.2 RC_53.1 RC_53.2  [also labelled C1]
BATT_2-3: JB7.3 JB13.2 RC_54.1 RC_54.2 RC_55.1 RC_55.2 RC_56.1 RC_56.2 RC_57.1 RC_57.2 RC_58.1 RC_58.2 RC_59.1 RC_59.2 RC_60.1 RC_60.2 RC_61.1 RC_61.2 RC_62.1 RC_62.2 RC_63.1 RC_63.2 RC_64.1 RC_64.2 RC_65.1 RC_65.2 RC_66.1 RC_66.2 RC_67.1 RC_67.2 RC_68.1 RC_68.2 RC_69.1 RC_69.2 RC_70.1 RC_70.2 RC_71.1 RC_71.2 RC_72.1 RC_72.2 RC_73.1 RC_73.2 RC_74.1 RC_74.2 RC_75.1 RC_75.2 RC_76.1 RC_76.2 RC_77.1 RC_77.2 RC_78.1 RC_78.2 RC_79.1 RC_79.2 RC_80.1 RC_80.2 RC_81.1 RC_81.2 RC_82.1 RC_82.2 RC_83.1 RC_83.2 RC_84.1 RC_84.2 RC_85.1 RC_85.2 RC_86.1 RC_86.2 RC_87.1 RC_87.2 RC_88.1 RC_88.2 RC_89.1 RC_89.2  [also labelled C2]
BATT_3-4: JB7.4 JB13.1 NT_3_4.2 RC_90.1 RC_90.2 RC_91.1 RC_91.2 RC_92.1 RC_92.2 RC_93.1 RC_93.2 RC_94.1 RC_94.2 RC_95.1 RC_95.2 RC_96.1 RC_96.2 RC_97.1 RC_97.2 RC_98.1 RC_98.2 RC_99.1 RC_99.2 RC_100.1 RC_100.2 RC_101.1 RC_101.2 RC_102.1 RC_102.2 RC_103.1 RC_103.2 RC_104.1 RC_104.2 RC_105.1 RC_105.2 RC_106.1 RC_106.2 RC_107.1 RC_107.2 RC_108.1 RC_108.2 RC_109.1 RC_109.2 RC_110.1 RC_110.2 RC_111.1 RC_111.2 RC_112.1 RC_112.2 RC_113.1 RC_113.2 RC_114.1 RC_114.2 RC_115.1 RC_115.2 RC_116.1 RC_116.2 RC_117.1 RC_117.2 RC_118.1 RC_118.2 RC_119.1 RC_119.2 RC_120.1 RC_120.2 RC_121.1 RC_121.2 RC_122.1 RC_122.2 RC_123.1 RC_123.2 RC_124.1 RC_124.2 RC_125.1 RC_125.2  [also labelled C3]
BATT_4-5: JB8.2 JB14.3 RC_126.1 RC_126.2 RC_127.1 RC_127.2 RC_128.1 RC_128.2 RC_129.1 RC_129.2 RC_130.1 RC_130.2 RC_131.1 RC_131.2 RC_132.1 RC_132.2 RC_133.1 RC_133.2 RC_134.1 RC_134.2 RC_135.1 RC_135.2 RC_136.1 RC_136.2 RC_137.1 RC_137.2 RC_138.1 RC_138.2 RC_139.1 RC_139.2 RC_140.1 RC_140.2 RC_141.1 RC_141.2 RC_142.1 RC_142.2 RC_143.1 RC_143.2 RC_144.1 RC_144.2 RC_145.1 RC_145.2 RC_146.1 RC_146.2 RC_147.1 RC_147.2 RC_148.1 RC_148.2 RC_149.1 RC_149.2 RC_150.1 RC_150.2 RC_151.1 RC_151.2 RC_152.1 RC_152.2 RC_153.1 RC_153.2 RC_154.1 RC_154.2 RC_155.1 RC_155.2 RC_156.1 RC_156.2 RC_157.1 RC_157.2 RC_158.1 RC_158.2 RC_159.1 RC_159.2 RC_160.1 RC_160.2 RC_161.1 RC_161.2  [also labelled C5]
BATT_5-6: JB8.3 JB14.2 RC_162.1 RC_162.2 RC_163.1 RC_163.2 RC_164.1 RC_164.2 RC_165.1 RC_165.2 RC_166.1 RC_166.2 RC_167.1 RC_167.2 RC_168.1 RC_168.2 RC_169.1 RC_169.2 RC_170.1 RC_170.2 RC_171.1 RC_171.2 RC_172.1 RC_172.2 RC_173.1 RC_173.2 RC_174.1 RC_174.2 RC_175.1 RC_175.2 RC_176.1 RC_176.2 RC_177.1 RC_177.2 RC_178.1 RC_178.2 RC_179.1 RC_179.2 RC_180.1 RC_180.2 RC_181.1 RC_181.2 RC_182.1 RC_182.2 RC_183.1 RC_183.2 RC_184.1 RC_184.2 RC_185.1 RC_185.2 RC_186.1 RC_186.2 RC_187.1 RC_187.2 RC_188.1 RC_188.2 RC_189.1 RC_189.2 RC_190.1 RC_190.2 RC_191.1 RC_191.2 RC_192.1 RC_192.2 RC_193.1 RC_193.2 RC_194.1 RC_194.2 RC_195.1 RC_195.2 RC_196.1 RC_196.2 RC_197.1 RC_197.2  [also labelled C6]
BATT_6-7: JB8.4 JB14.1 RC_198.1 RC_198.2 RC_199.1 RC_199.2 RC_200.1 RC_200.2 RC_201.1 RC_201.2 RC_202.1 RC_202.2 RC_203.1 RC_203.2 RC_204.1 RC_204.2 RC_205.1 RC_205.2 RC_206.1 RC_206.2 RC_207.1 RC_207.2 RC_208.1 RC_208.2 RC_209.1 RC_209.2 RC_210.1 RC_210.2 RC_211.1 RC_211.2 RC_212.1 RC_212.2 RC_213.1 RC_213.2 RC_214.1 RC_214.2 RC_215.1 RC_215.2 RC_216.1 RC_216.2 RC_217.1 RC_217.2 RC_218.1 RC_218.2 RC_219.1 RC_219.2 RC_220.1 RC_220.2 RC_221.1 RC_221.2 RC_222.1 RC_222.2 RC_223.1 RC_223.2 RC_224.1 RC_224.2 RC_225.1 RC_225.2 RC_226.1 RC_226.2 RC_227.1 RC_227.2 RC_228.1 RC_228.2 RC_229.1 RC_229.2 RC_230.1 RC_230.2 RC_231.1 RC_231.2 RC_232.1 RC_232.2 RC_233.1 RC_233.2  [also labelled C7]
BATT_7-8: JB9.1 JB15.4 NT_8_9.1 RC_234.1 RC_234.2 RC_235.1 RC_235.2 RC_236.1 RC_236.2 RC_237.1 RC_237.2 RC_238.1 RC_238.2 RC_239.1 RC_239.2 RC_240.1 RC_240.2 RC_241.1 RC_241.2 RC_242.1 RC_242.2 RC_243.1 RC_243.2 RC_244.1 RC_244.2 RC_245.1 RC_245.2 RC_246.1 RC_246.2 RC_247.1 RC_247.2 RC_248.1 RC_248.2 RC_249.1 RC_249.2 RC_250.1 RC_250.2 RC_251.1 RC_251.2 RC_252.1 RC_252.2 RC_253.1 RC_253.2 RC_254.1 RC_254.2 RC_255.1 RC_255.2 RC_256.1 RC_256.2 RC_257.1 RC_257.2 RC_258.1 RC_258.2 RC_259.1 RC_259.2 RC_260.1 RC_260.2 RC_261.1 RC_261.2 RC_262.1 RC_262.2 RC_263.1 RC_263.2 RC_264.1 RC_264.2 RC_265.1 RC_265.2 RC_266.1 RC_266.2 RC_267.1 RC_267.2 RC_268.1 RC_268.2 RC_269.1 RC_269.2  [also labelled C8]
BATT_8-9: JB9.3 JB15.2 RC_270.1 RC_270.2 RC_271.1 RC_271.2 RC_272.1 RC_272.2 RC_273.1 RC_273.2 RC_274.1 RC_274.2 RC_275.1 RC_275.2 RC_276.1 RC_276.2 RC_277.1 RC_277.2 RC_278.1 RC_278.2 RC_279.1 RC_279.2 RC_280.1 RC_280.2 RC_281.1 RC_281.2 RC_282.1 RC_282.2 RC_283.1 RC_283.2 RC_284.1 RC_284.2 RC_285.1 RC_285.2 RC_286.1 RC_286.2 RC_287.1 RC_287.2 RC_288.1 RC_288.2 RC_289.1 RC_289.2 RC_290.1 RC_290.2 RC_291.1 RC_291.2 RC_292.1 RC_292.2 RC_293.1 RC_293.2 RC_294.1 RC_294.2 RC_295.1 RC_295.2 RC_296.1 RC_296.2 RC_297.1 RC_297.2 RC_298.1 RC_298.2 RC_299.1 RC_299.2 RC_300.1 RC_300.2 RC_301.1 RC_301.2 RC_302.1 RC_302.2 RC_303.1 RC_303.2 RC_304.1 RC_304.2 RC_305.1 RC_305.2  [also labelled C10]
BATT_9-10: JB9.4 JB15.1 RC_306.1 RC_306.2 RC_307.1 RC_307.2 RC_308.1 RC_308.2 RC_309.1 RC_309.2 RC_310.1 RC_310.2 RC_311.1 RC_311.2 RC_312.1 RC_312.2 RC_313.1 RC_313.2 RC_314.1 RC_314.2 RC_315.1 RC_315.2 RC_316.1 RC_316.2 RC_317.1 RC_317.2 RC_318.1 RC_318.2 RC_319.1 RC_319.2 RC_320.1 RC_320.2 RC_321.1 RC_321.2 RC_322.1 RC_322.2 RC_323.1 RC_323.2 RC_324.1 RC_324.2 RC_325.1 RC_325.2 RC_326.1 RC_326.2 RC_327.1 RC_327.2 RC_328.1 RC_328.2 RC_329.1 RC_329.2 RC_330.1 RC_330.2 RC_331.1 RC_331.2 RC_332.1 RC_332.2 RC_333.1 RC_333.2 RC_334.1 RC_334.2 RC_335.1 RC_335.2 RC_336.1 RC_336.2 RC_337.1 RC_337.2 RC_338.1 RC_338.2 RC_339.1 RC_339.2 RC_340.1 RC_340.2 RC_341.1 RC_341.2  [also labelled C11]
BATT_10-11: JB10.1 JB16.4 RC_342.1 RC_342.2 RC_343.1 RC_343.2 RC_344.1 RC_344.2 RC_345.1 RC_345.2 RC_346.1 RC_346.2 RC_347.1 RC_347.2 RC_348.1 RC_348.2 RC_349.1 RC_349.2 RC_350.1 RC_350.2 RC_351.1 RC_351.2 RC_352.1 RC_352.2 RC_353.1 RC_353.2 RC_354.1 RC_354.2 RC_355.1 RC_355.2 RC_356.1 RC_356.2 RC_357.1 RC_357.2 RC_358.1 RC_358.2 RC_359.1 RC_359.2 RC_360.1 RC_360.2 RC_361.1 RC_361.2 RC_362.1 RC_362.2 RC_363.1 RC_363.2 RC_364.1 RC_364.2 RC_365.1 RC_365.2 RC_366.1 RC_366.2 RC_367.1 RC_367.2 RC_368.1 RC_368.2 RC_369.1 RC_369.2 RC_370.1 RC_370.2 RC_371.1 RC_371.2 RC_372.1 RC_372.2 RC_373.1 RC_373.2 RC_374.1 RC_374.2 RC_375.1 RC_375.2 RC_376.1 RC_376.2 RC_377.1 RC_377.2  [also labelled C12]
BATT_11-12: JB10.3 JB16.2 NT_13_14.2 NT_13_14_2.2 RC_378.1 RC_378.2 RC_379.1 RC_379.2 RC_380.1 RC_380.2 RC_381.1 RC_381.2 RC_382.1 RC_382.2 RC_383.1 RC_383.2 RC_384.1 RC_384.2 RC_385.1 RC_385.2 RC_386.1 RC_386.2 RC_387.1 RC_387.2 RC_388.1 RC_388.2 RC_389.1 RC_389.2 RC_390.1 RC_390.2 RC_391.1 RC_391.2 RC_392.1 RC_392.2 RC_393.1 RC_393.2 RC_394.1 RC_394.2 RC_395.1 RC_395.2 RC_396.1 RC_396.2 RC_397.1 RC_397.2 RC_398.1 RC_398.2 RC_399.1 RC_399.2 RC_400.1 RC_400.2 RC_401.1 RC_401.2 RC_402.1 RC_402.2 RC_403.1 RC_403.2 RC_404.1 RC_404.2 RC_405.1 RC_405.2 RC_406.1 RC_406.2 RC_407.1 RC_407.2 RC_408.1 RC_408.2 RC_409.1 RC_409.2 RC_410.1 RC_410.2 RC_411.1 RC_411.2 RC_412.1 RC_412.2 RC_413.1 RC_413.2  [also labelled C14]
BATT_12: JB4.1 JB4.2 JB4.3 JB4.4 JB5.1 JB5.2 JB5.3 JB5.4 JB6.1 JB6.2 JB6.3 JB6.4 JB10.4 JB16.1 RC_414.1 RC_414.2 RC_415.1 RC_415.2 RC_416.1 RC_416.2 RC_417.1 RC_417.2 RC_418.1 RC_418.2 RC_419.1 RC_419.2 RC_420.1 RC_420.2 RC_421.1 RC_421.2 RC_422.1 RC_422.2 RC_423.1 RC_423.2 RC_424.1 RC_424.2 RC_425.1 RC_425.2 RC_426.1 RC_426.2 RC_427.1 RC_427.2 RC_428.1 RC_428.2 RC_429.1 RC_429.2 RC_430.1 RC_430.2 RC_431.1 RC_431.2  [also labelled C15]
C4: JB8.1 JB14.4 NT_3_4.1
C9: JB9.2 JB15.3 NT_8_9.2
C13: JB10.2 JB16.3 NT_13_14.1 NT_13_14_2.1
TS_0: JB11.2 JB17.3 TSB_1.1 TSB_1-2.2
TS_1: JB11.3 JB17.2 TSB_2_3.2 TSB_3-4.2
TS_2: JB11.4 JB17.1 TSB_4_5.2 TSB_5-6.2
TS_3: JB12.1 JB18.4 TSB_6_7.2 TSB_7-8.2
TS_4: JB12.2 JB18.3 TSB_8_9.2 TSB_9-10.2
TS_5: JB12.3 JB18.2 TSB_10_11.2 TSB_11-12.2
TS_6: JB12.4 JB18.1 TSB_12.1
TS_A_GND: JB17.4 TSB_1-2.1 TSB_3-4.1 TSB_5-6.1 TSB_7-8.1 TSB_9-10.1 TSB_11-12.1
TS_B_GND: JB11.1 TSB_1.2 TSB_2_3.1 TSB_4_5.1 TSB_6_7.1 TSB_8_9.1 TSB_10_11.1 TSB_12.2

### Notes on the sheet
- B1
- B2
- B3
- B4
- B5
- B6
- B7
- B8
- B9
- B10
- B11
- B12

### Library data of the parts
JB1-JB18 = 47615-0001: Battery Spring x4
NT_3_4 NT_8_9 NT_13_14 NT_13_14_2 = NET_TIE: R - Net Tie
RC_0-RC_431 = 0603WAF0000T5E: R - RESISTOR - SMD - 0R - 1% - 0603; LCSC Part #: C21189; JLC Availability: Basic
TSB_1 TSB_1-2 TSB_2_3 TSB_3-4 TSB_4_5 TSB_5-6 TSB_6_7 TSB_7-8 TSB_8_9 TSB_9-10 TSB_10_11 TSB_11-12 TSB_12 = NCP15XH103F03RC: RT - NTC THERMISTOR - 10k - 1% - 0402; Value2: 3380k; LCSC Part #: C77131; JLC Availability: Extended